# Altium schematic sheet MCU_POWER.SchDoc
size A4; SheetNumber: 1; SheetTotal: 3; SPICEModelCacheYCYUXXQG: <root> / <DocumentId>YCYUXXQG</DocumentId> / </root>
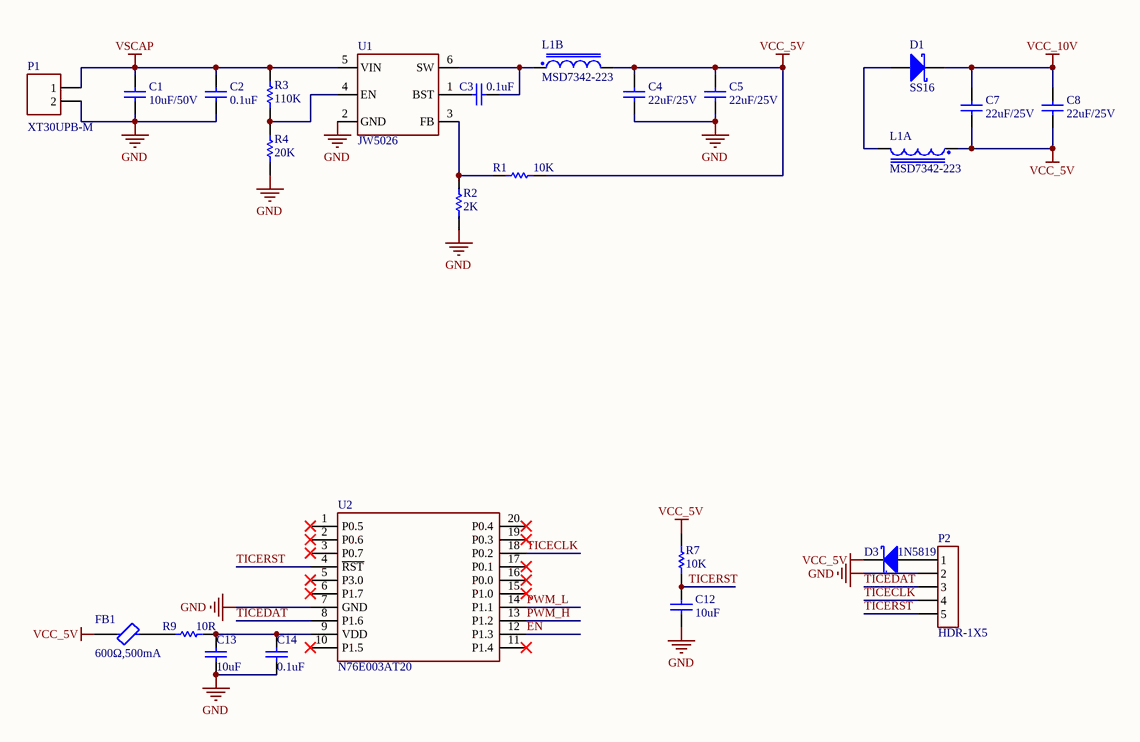
[diagram p0: MCU_POWER.SchDoc]

## Parts
C1  10uF/50V  [C0805_M]
C2  0.1uF  [C0603_M]
C3  0.1uF  [C0603_M]
C4  22uF/25V  [C0805_M]
C5  22uF/25V  [C0805_M]
C7  22uF/25V  [C0805_M]
C8  22uF/25V  [C0805_M]
C12  10uF  [C0603_M]
C13  10uF  [C0603_M]
C14  0.1uF  [C0603_M]
D1  SS16  [SOD-123]
D3  1N5819  [SOD-323]
FB1  600Ω,500mA  [FB0603_M]
L1  MSD7342-223  [MSD7342]  (parts A,B of 2)
P1  XT30UPB-M  [XT30UPB-M]
P2  HDR-1X5  [HDR2.54-LI-5P]
R1  10K  [R0603_M]
R2  2K  [R0603_M]
R3  110K  [R0603_M]
R4  20K  [R0603_M]
R7  10K  [R0603_M]
R9  10R  [R0603_M]
U1  JW5026  [SOT23-6N]
U2  N76E003AT20  [TSSOP20_N]

## Nets
GND: C1.1 C2.1 C4.1 C5.1 C12.1 C13.1 C14.1 P1.2 P2.2 R2.2 R4.2 U1.2(GND) U2.7(GND)
VCC_5V: C4.2 C5.2 C7.1 C8.1 D3.2(K) FB1.1 L1.1 L1.4 R1.2 R7.1
VCC_10V: C7.2 C8.2 D1.2(K)
VSCAP: C1.2 C2.2 P1.1 R3.2 U1.5(VIN)
EN: U2.12(P1.3)
PWM_H: U2.13(P1.2)
PWM_L: U2.14(P1.1)
TICECLK: P2.4 U2.18(P0.2)
TICEDAT: P2.3 U2.8(P1.6)
TICERST: C12.2 P2.5 R7.2 U2.4(~{RST})
NetC3_1: C3.1 U1.1(BST)
NetC3_2: C3.2 L1.2 U1.6(SW)
NetC13_2: C13.2 C14.2 R9.2 U2.9(VDD)
NetD1_1: D1.1(A) L1.3
NetD3_1: D3.1(A) P2.1
NetFB1_2: FB1.2 R9.1
NetR1_1: R1.1 R2.1 U1.3(FB)
NetR3_1: R3.1 R4.1 U1.4(EN)

Not connected (* = marked no-connect by the designer): U2 1(P0.5)* 2(P0.6)* 3(P0.7)* 5(P3.0)* 6(P1.7)* 10(P1.5)* 11(P1.4)* 15(P1.0)* 16(P0.0)* 17(P0.1)* 19(P0.3)* 20(P0.4)*

## Library data of the parts
C1-C5 C7 C8 C12-C14 = Cap: Capacitor
D1 D3 = D Schottky: Schottky Diode; Published: 8-Jun-2000; LatestRevisionDate: 17-Jul-2002; LatestRevisionNote: Re-released for DXP Platform.; PackageReference: SMB; Publisher: Altium Limited; PackageDescription: DO-214-AA/SMB; 2 C-Bend Leads; Body 5.3 x 3.6 mm, inc. leads (LxW); Code_JEDEC: DO-214-AA
FB1 = Ferrite Bead
L1 = Coupled Inductor
P1 = XT30UPB-F: pin to pad: 1>+ 2>-
R1-R4 R7 R9 = Res1: Resistor